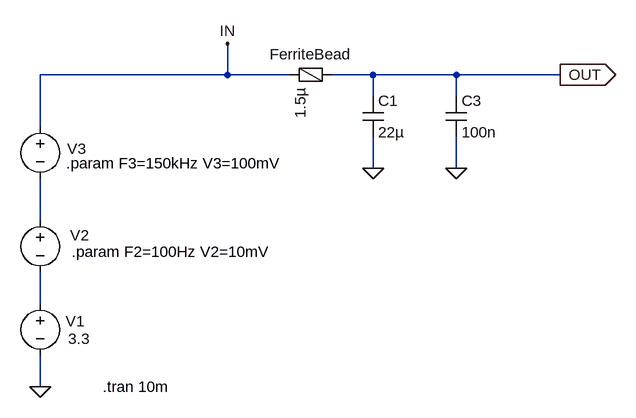
[diagram p0: schematic v1.0.asc]
v1.0.asc, the LTspice schematic file:
Version 4.1
SHEET 1 1452 680
WIRE 304 96 304 48
WIRE 304 96 16 96
WIRE 400 96 304 96
WIRE 528 96 464 96
WIRE 656 96 528 96
WIRE 816 96 656 96
WIRE 528 128 528 96
WIRE 656 128 656 96
WIRE 16 176 16 96
WIRE 528 240 528 192
WIRE 656 240 656 192
WIRE 16 320 16 256
WIRE 16 448 16 400
WIRE 16 576 16 528
FLAG 16 576 0
FLAG 816 96 OUT
IOPIN 816 96 Out
FLAG 656 240 0
FLAG 528 240 0
FLAG 304 48 IN
SYMBOL voltage 16 160 R0
WINDOW 0 56 34 Top 2
WINDOW 3 -39 66 Invisible 2
WINDOW 123 0 0 Left 0
WINDOW 39 0 0 Left 0
SYMATTR InstName V3
SYMATTR Value PULSE(0 {V3} 0 {0.5/F3} {0.5/F3} 0 {1/F3})
SYMBOL FerriteBead 432 96 R90
WINDOW 0 -16 0 VBottom 2
SYMATTR InstName FerriteBead
SYMATTR Value 1.5µ
SYMATTR SpiceLine Ipk=0.2 Rser=0.34 Rpar=3700 Cpar=1.4p
SYMBOL cap 640 128 R0
SYMATTR InstName C3
SYMATTR Value 100n
SYMATTR SpiceLine Rser=0.020
SYMBOL cap 512 128 R0
SYMATTR InstName C1
SYMATTR Value 22µ
SYMATTR SpiceLine Rser=0.020
SYMBOL voltage 16 304 R0
WINDOW 0 46 39 Left 2
WINDOW 3 -63 23 Invisible 2
WINDOW 123 0 0 Left 0
WINDOW 39 0 0 Left 0
SYMATTR InstName V2
SYMATTR Value SINE(0 {V2} {F2})
SYMBOL voltage 16 432 R0
WINDOW 0 39 43 Left 2
WINDOW 3 43 70 Left 2
WINDOW 123 0 0 Left 0
WINDOW 39 0 0 Left 0
SYMATTR InstName V1
SYMATTR Value 3.3
TEXT 112 576 Left 2 !.tran 10m
TEXT 56 232 Left 2 !.param F3=150kHz V3=100mV
TEXT 64 368 Left 2 !.param F2=100Hz V2=10mV

The netlist it stands for:
* v1.0.asc
V3 IN N001 PULSE(0 {V3} 0 {0.5/F3} {0.5/F3} 0 {1/F3})
L§FerriteBead OUT IN 1.5µ Ipk=0.2 Rser=0.34 Rpar=3700 Cpar=1.4p
C3 OUT 0 100n Rser=0.020
C1 OUT 0 22µ Rser=0.020
V2 N001 N002 SINE(0 {V2} {F2})
V1 N002 0 3.3
.tran 10m
.param F3=150kHz V3=100mV
.param F2=100Hz V2=10mV
.backanno
.end